# EAGLE design door_tx (EAGLE 7.1.0)
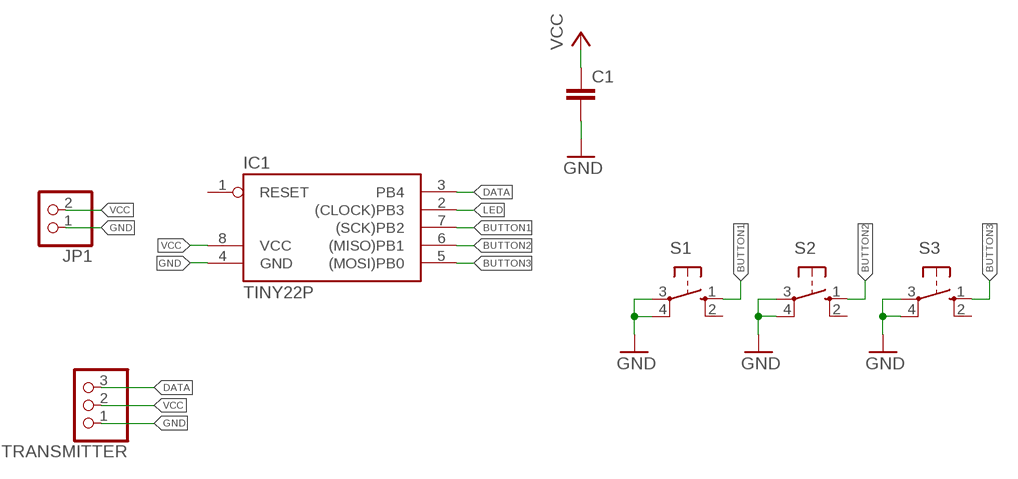
[diagram p0: schematic, sheet 1]

## Parts
C1  C-EUC1206K  [C1206K]
IC1  TINY22P  [DIL08]
JP1  PINHD-1X2  [1X02]
S1  10-XX  [B3F-10XX]
S2  10-XX  [B3F-10XX]
S3  10-XX  [B3F-10XX]
TRANSMITTER  PINHD-1X3  [1X03]

## Nets
BUTTON1: IC1.7((SCK)PB2) S1.1(S)
BUTTON2: IC1.6((MISO)PB1) S2.1(S)
BUTTON3: IC1.5((MOSI)PB0) S3.1(S)
DATA: IC1.3(PB4) TRANSMITTER.3
GND: C1.2 IC1.4(GND) JP1.1 S1.3(P) S1.4(P1) S2.3(P) S2.4(P1) S3.3(P) S3.4(P1) TRANSMITTER.1
LED: IC1.2((CLOCK)PB3)
VCC: C1.1 IC1.8(VCC) JP1.2 TRANSMITTER.2
Unconnected: IC1.1(RESET) S1.2(S1) S2.2(S1) S3.2(S1)

## Library data of the parts
C1 = rcl:C-EU: CAPACITOR, European symbol
IC1 = atmel:TINY22: MICROCONTROLLER 1K ROM 128 bytes RAM 128 bytes EEPROM; OC_FARNELL: unknown; OC_NEWARK: unknown
JP1 = pinhead:PINHD-1X2: PIN HEADER
S1-S3 = switch-omron:10-XX: OMRON SWITCH; MPN: B3F-1000; OC_FARNELL: 176432; OC_NEWARK: 36M3542
TRANSMITTER = pinhead:PINHD-1X3: PIN HEADER

## Board
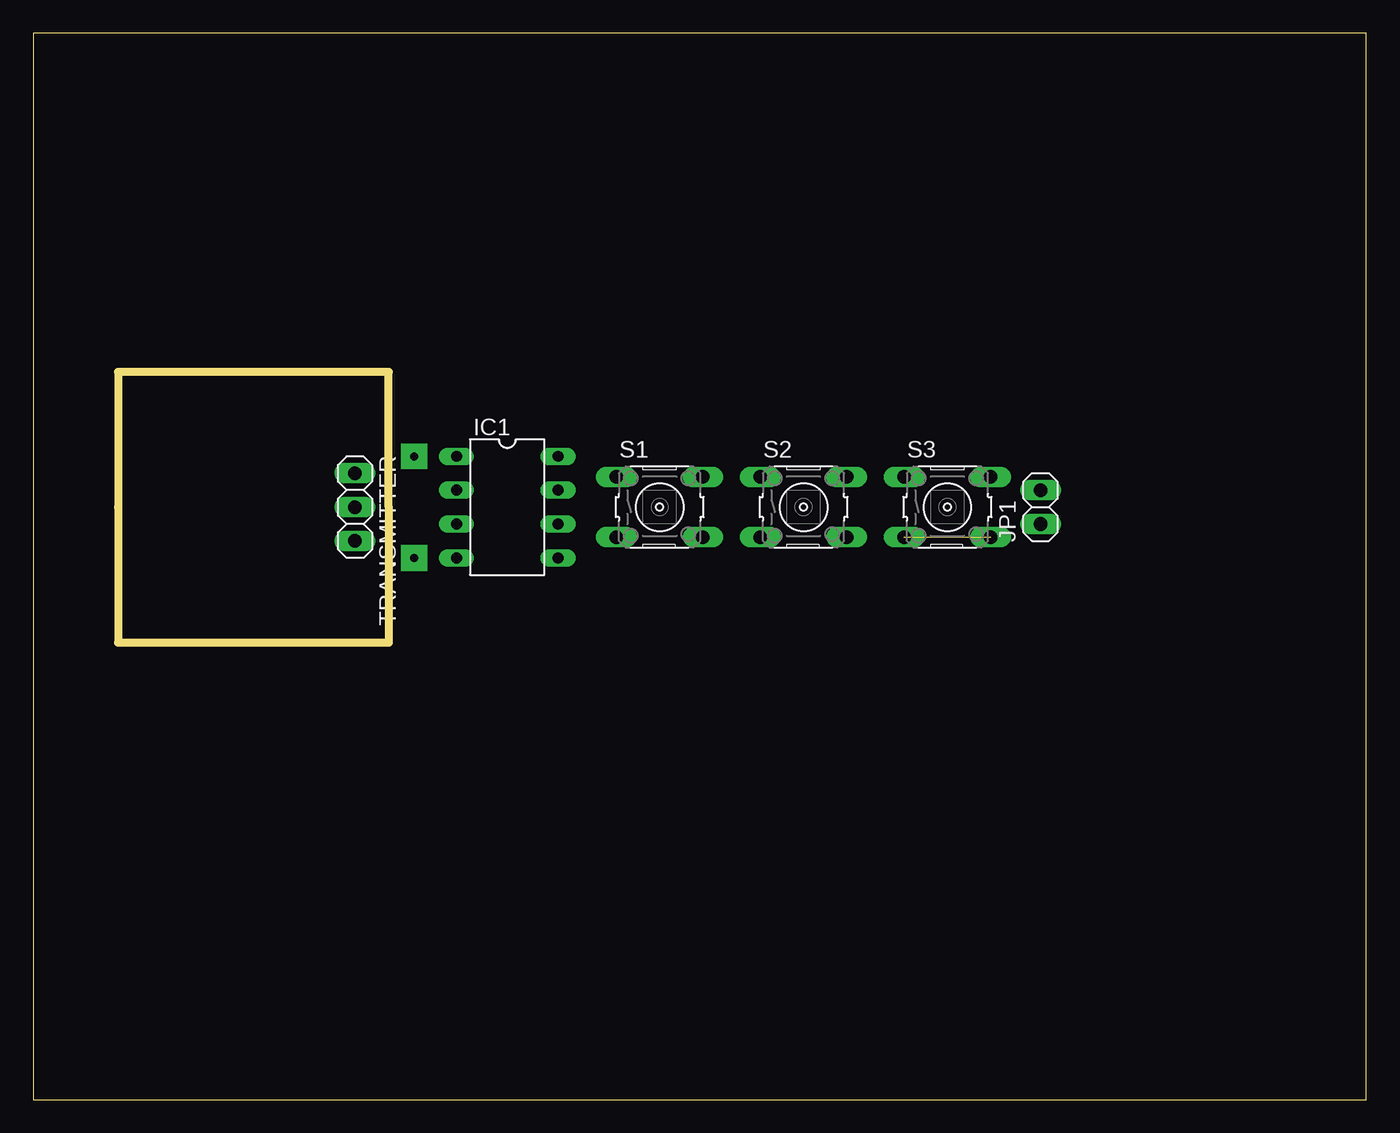
[diagram p1: board, top side]
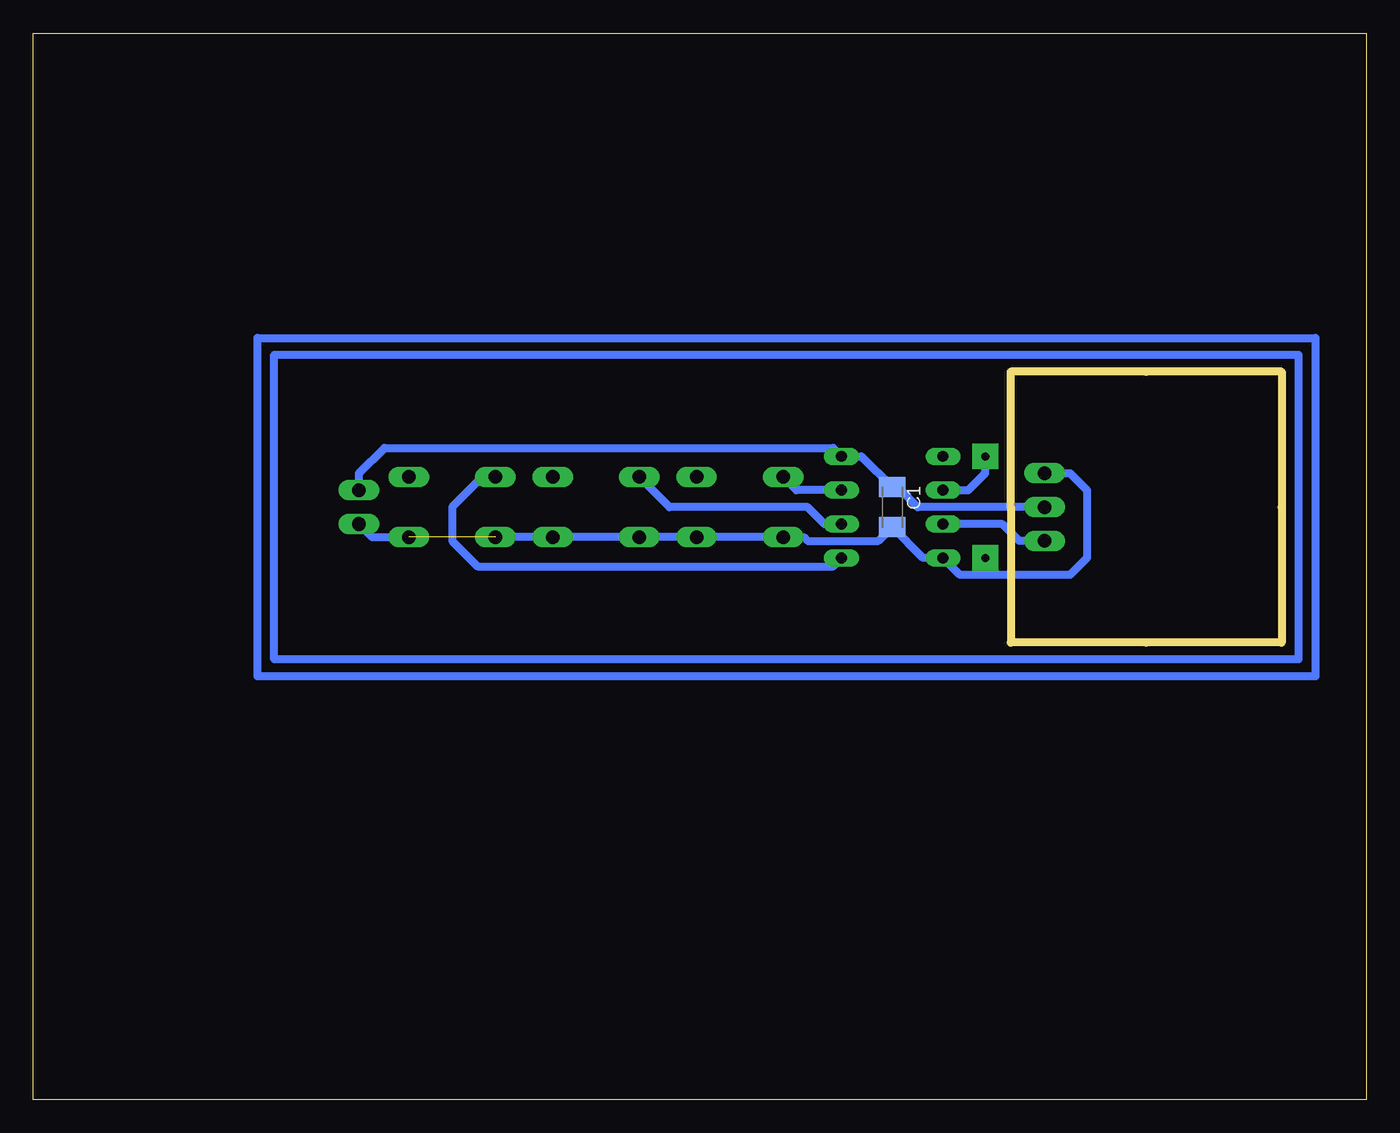
[diagram p2: board, bottom side, seen from below]

Size 100 x 80 mm. Coordinates in mm from the lower left corner, seen from the top.
Outline: 0,0 100,0 100,80 0,80 0,0
Outline: 26.67,44.45 26.67,54.61 16.51,54.61 6.35,54.61 6.35,44.45 6.35,34.29 16.51,34.29 26.67,34.29 26.67,44.45
Copper layers (1*16): Top 0.035mm / dielectric 1.5mm / Bottom 0.035mm
Design rules "default": minimum track width 10mil, minimum drill 24mil, track to track 8mil, track to pad 8mil, pad to pad 8mil, via to via 8mil, smd to smd 8mil, copper to edge 40mil, drill to drill 8mil, minimum pad ring 10mil, minimum via ring 8mil, stop-mask expansion 4mil, vias tented up to drill 0mil, thermal gap 10mil

### Footprints (pad centres in the part's own frame; a part is rotated, then mirrored left to right if it is on the bottom)
C1206K = smd 1.5 x 2: 1 -1.5,0; 2 1.5,0
DIL08 = drill 0.813 long: 1 -3.81,-3.81; 2 -1.27,-3.81; 3 1.27,-3.81; 4 3.81,-3.81; 5 3.81,3.81; 6 1.27,3.81; 7 -1.27,3.81; 8 -3.81,3.81
1X02 = drill 1.016 long: 1 -1.27,0; 2 1.27,0
B3F-10XX = drill 1.016 long: 1 -3.251,2.261; 2 3.251,2.261; 3 -3.251,-2.261; 4 3.251,-2.261
1X03 = drill 1.016 long: 1 -2.54,0; 2 0,0; 3 2.54,0

### Placement (x,y rotation side)
C1  35.56,44.45 270 bottom
IC1  35.56,44.45 270 top
JP1  75.56,44.45 90 top
S1  46.99,44.45 0 top
S2  57.78,44.45 0 top
S3  68.58,44.45 0 top
TRANSMITTER  24.13,44.45 270 top

### Tracks (layer width: path | path; a pad name or v marks a point on that pad's centre or on a via)
BUTTON1
  Bottom 0.61: IC1.7 42.75,45.72 S1.1
BUTTON2
  Bottom 0.61: IC1.6 40.64,43.18 41.91,44.45 52.27,44.45 S2.1
BUTTON3
  Bottom 0.61: S3.1 66.32,46.71 68.58,44.45 68.58,41.91 66.67,40.01 40.01,40.01 IC1.5
DATA
  Bottom 0.61: TRANSMITTER.3 26.04,41.91 27.3,43.18 IC1.3
GND  (via drill 0.6 pad 1.93)  (1 unrouted)
  Bottom 0.61: TRANSMITTER.1 22.23,46.99 20.95,45.72 20.95,40.64 22.23,39.37 28.57,39.37 | 28.57,39.37 30.48,39.37 IC1.4 33.25,40.64 C1.2 36.6,41.91 41.91,41.91 42.19,42.19 S1.3 S1.4 S2.3 S2.4 S3.3 | JP1.1 74.57,42.19 S3.4 | v28.57,40.64 28.57,39.37
LED  (via drill 0.6 pad 1.93)
  Bottom 0.61: IC1.2 29.84,45.72 28.57,46.99 v28.57,48.26
N$1
  Bottom 0.61: 5.08,33.02 81.92,33.02 81.92,55.88 5.08,55.88 5.08,33.02 | 83.19,57.15 3.81,57.15 3.81,31.75 83.19,31.75 83.19,57.15
VCC
  Bottom 0.61: TRANSMITTER.2 33.66,44.45 34.92,45.72 35.33,45.72 C1.1 37.87,48.26 IC1.8 40.01,48.9 73.66,48.9 75.56,46.99 JP1.2